# EAGLE board GameBit_Board (EAGLE 9.0.1), part 1 of 2
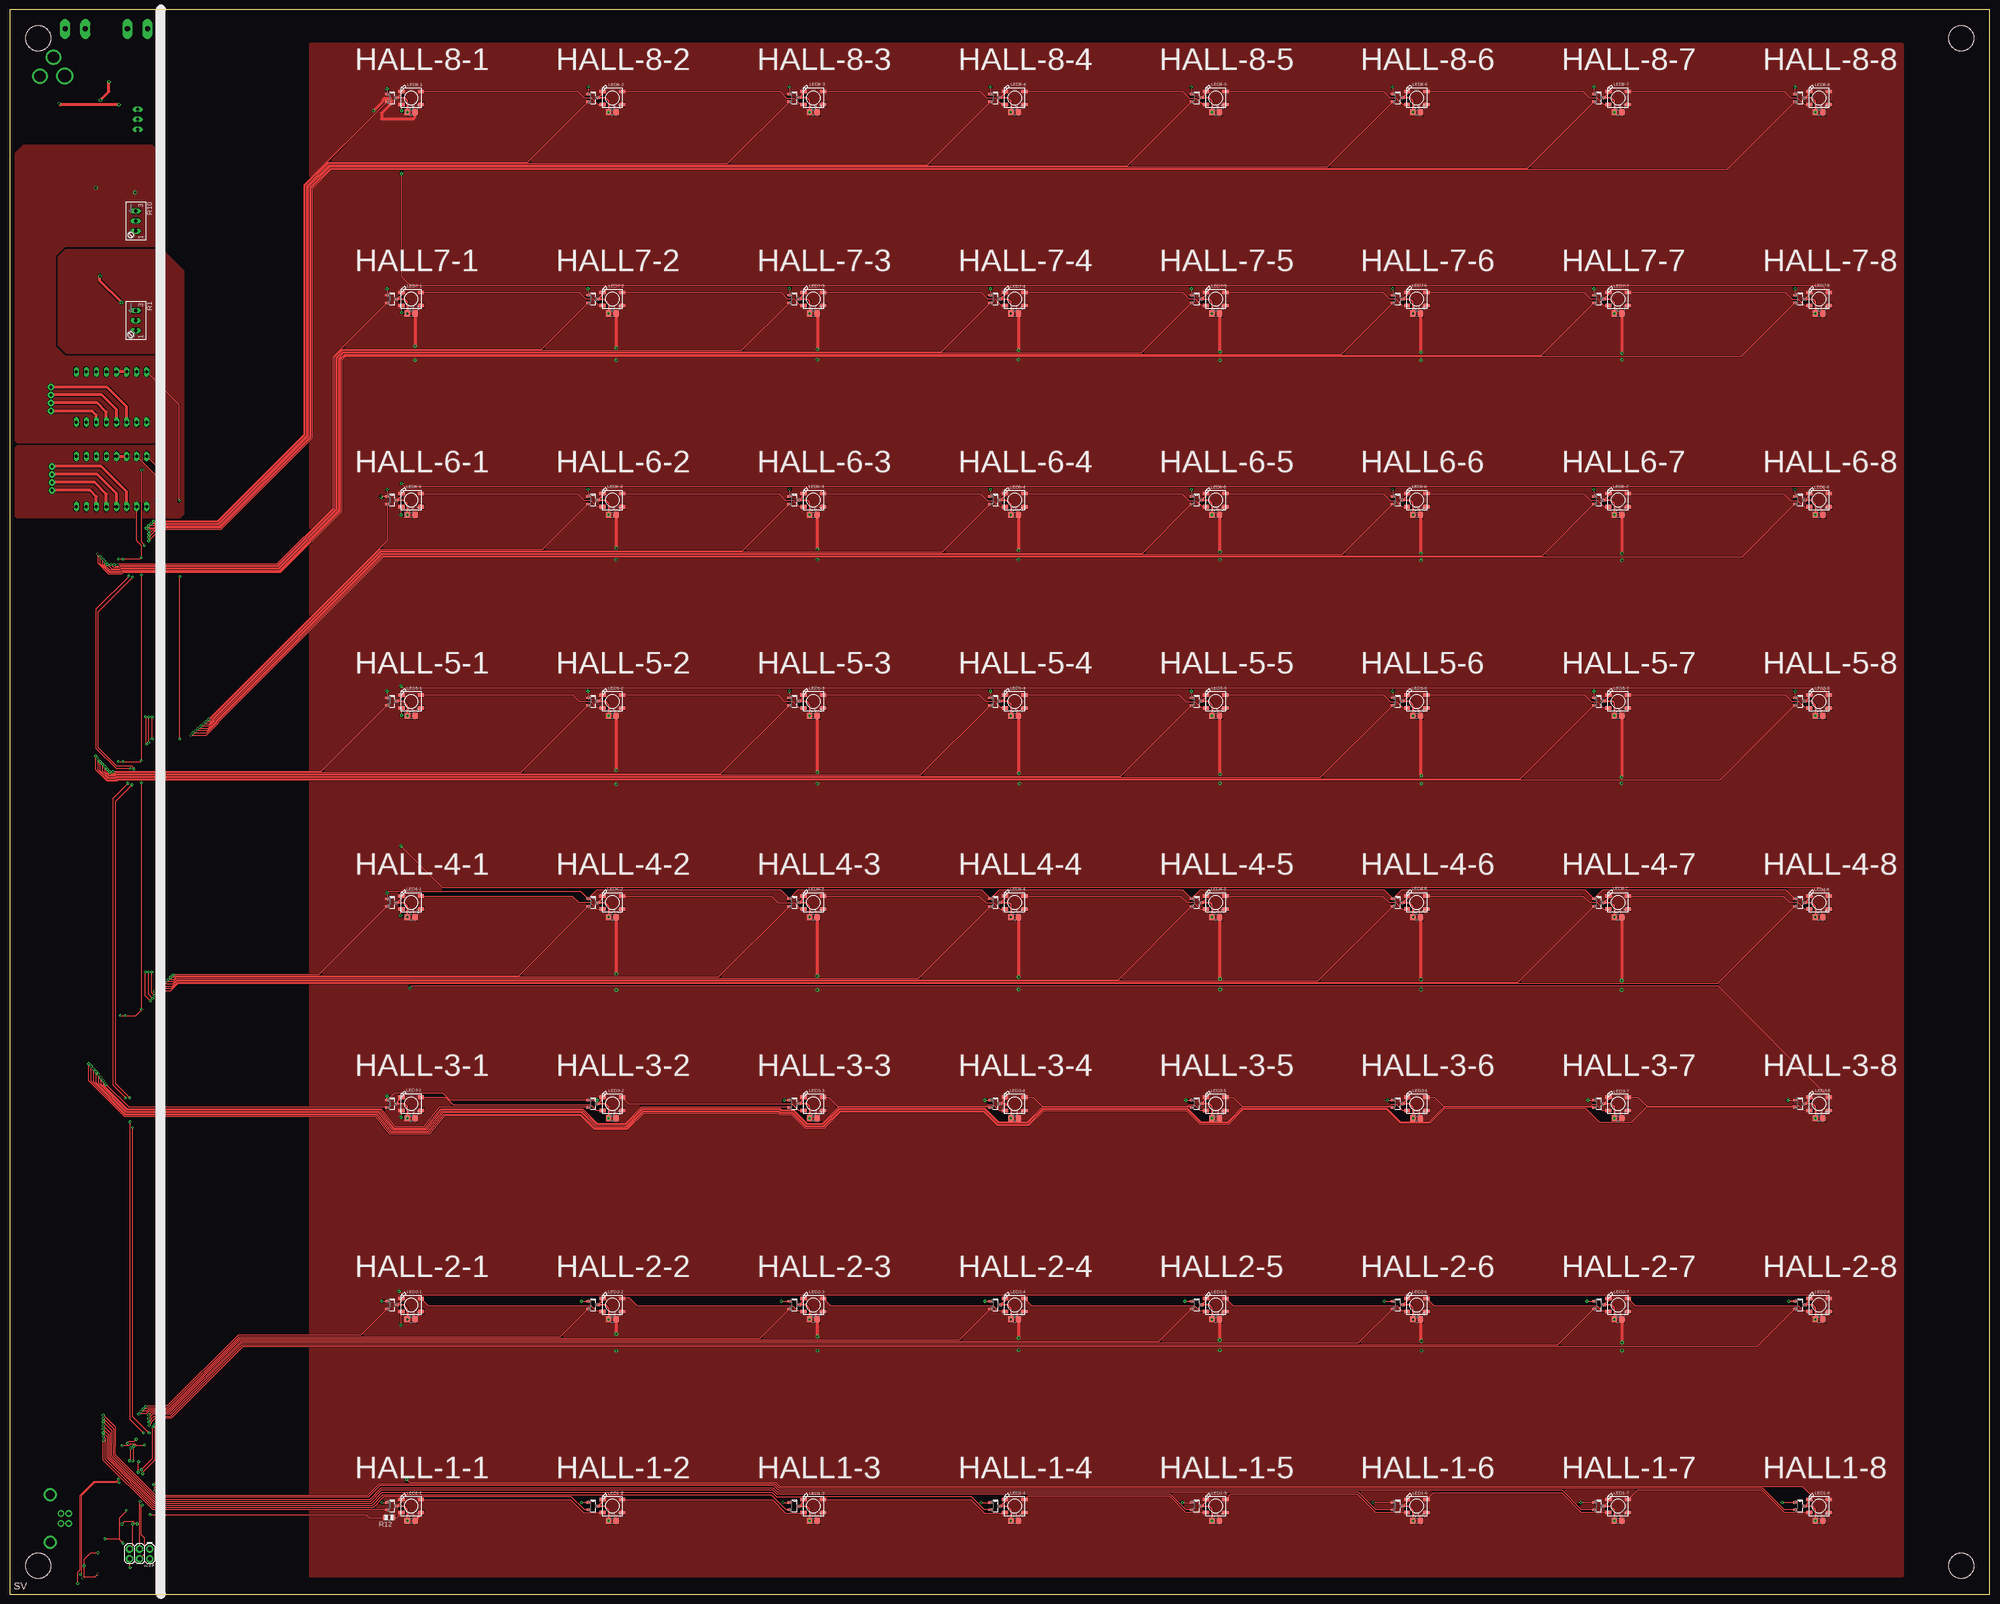
[diagram p3: board, top side]
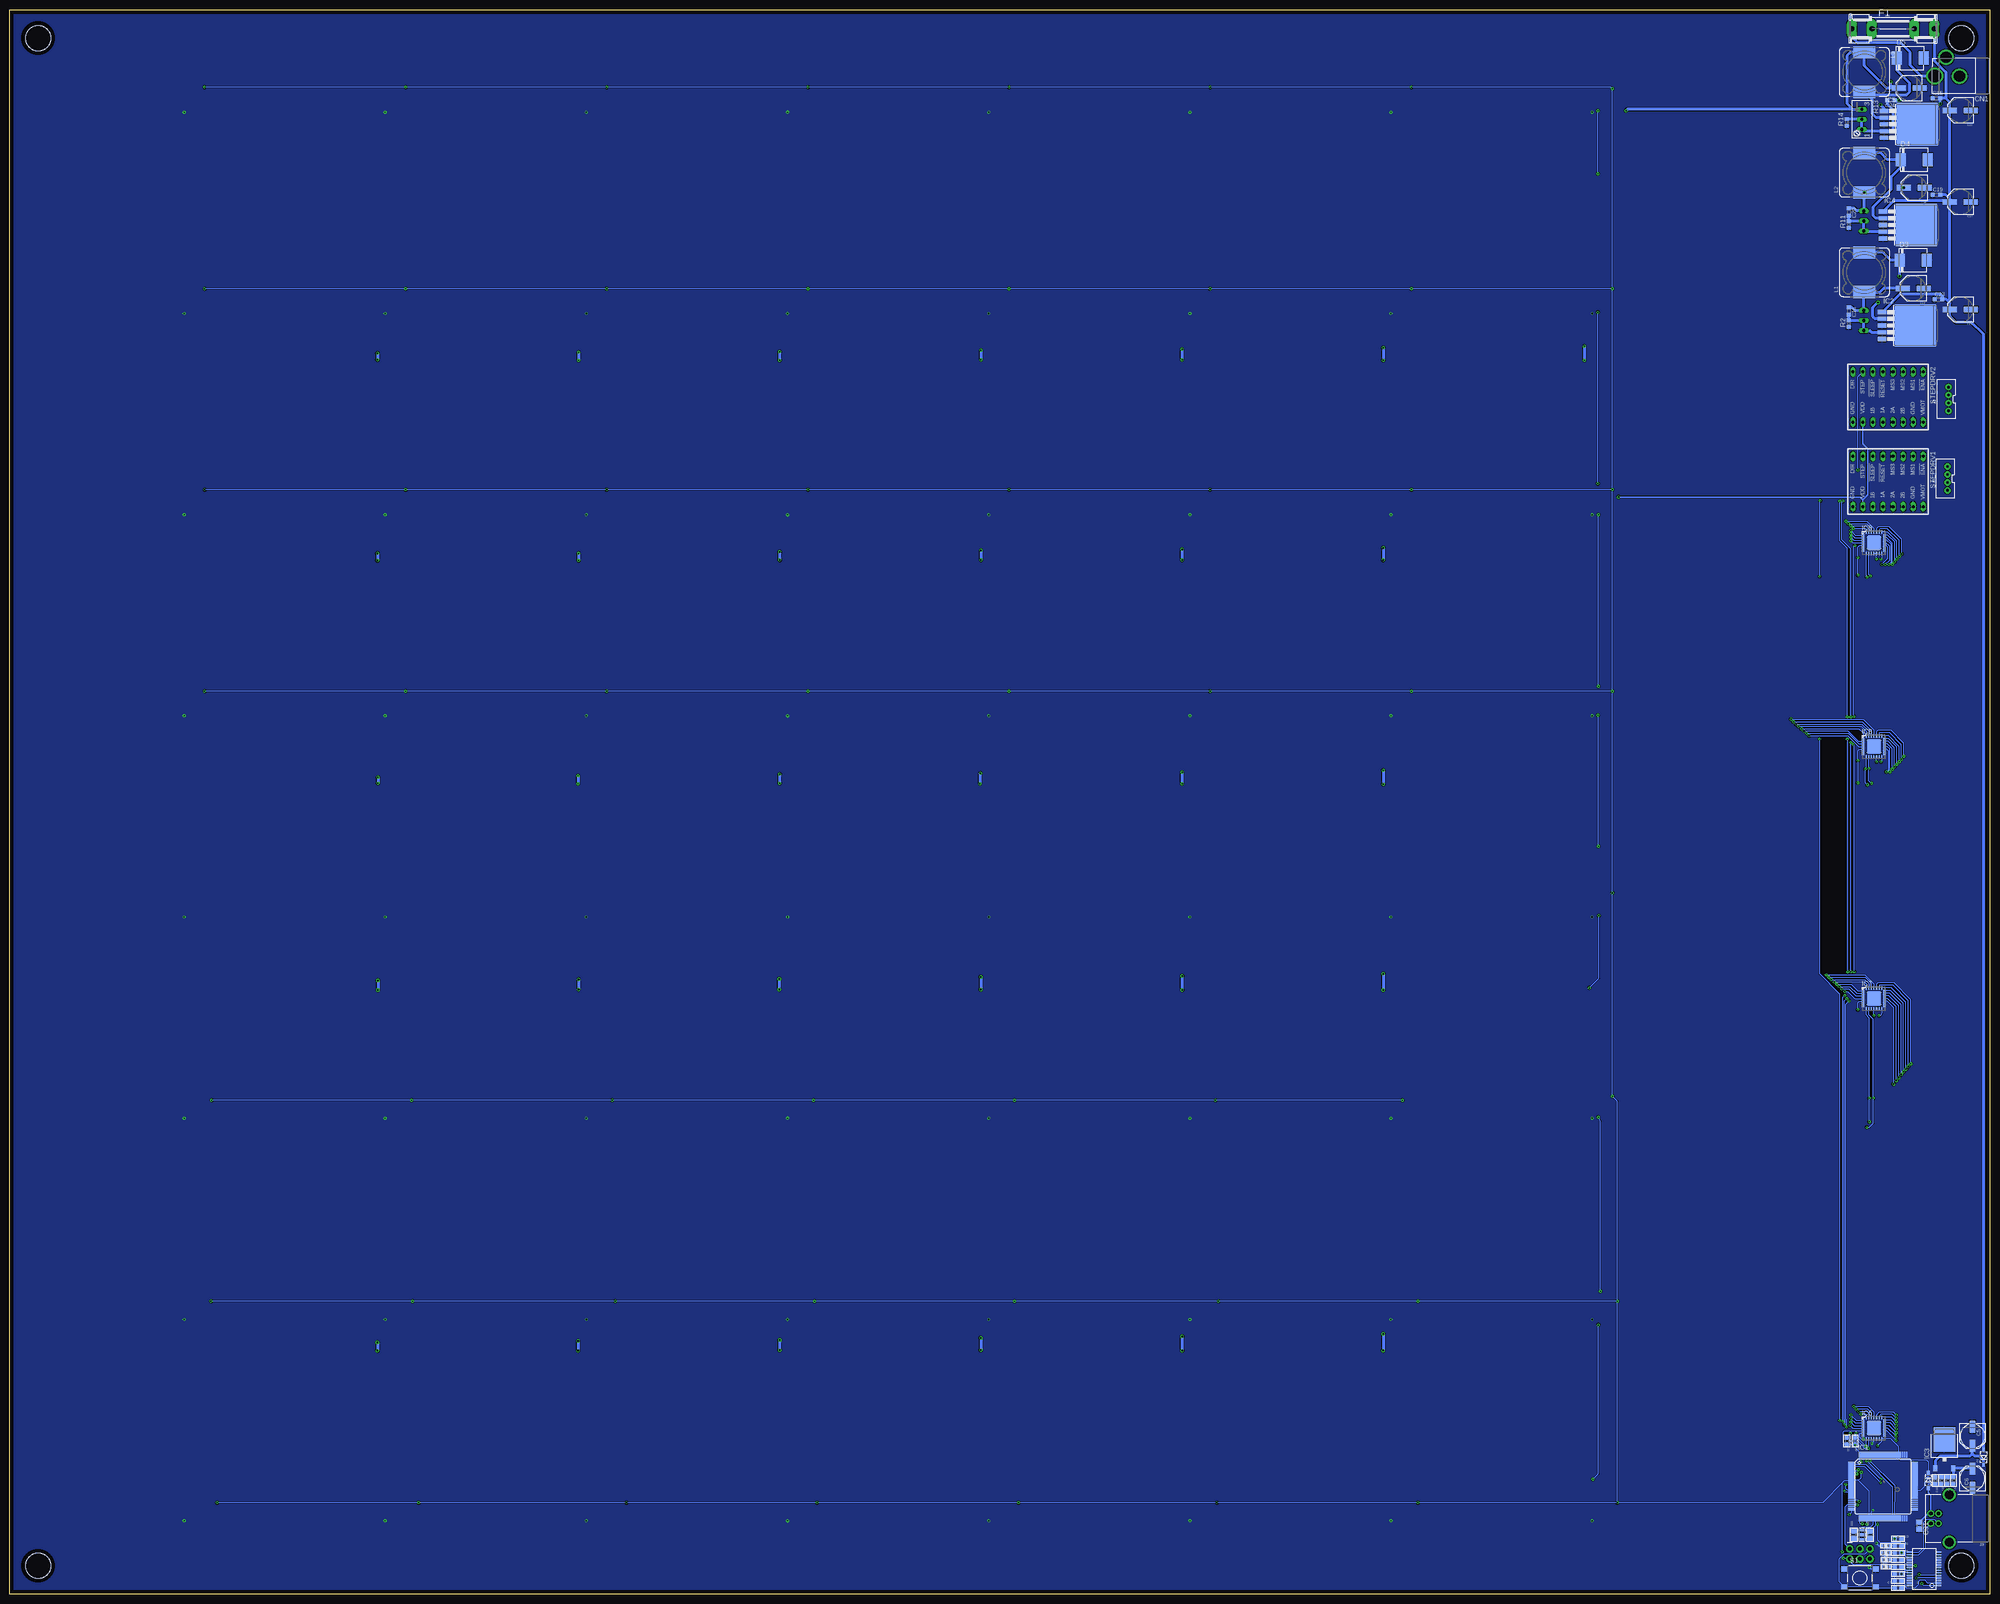
[diagram p4: board, bottom side, seen from below]

Size 500 x 400 mm. Coordinates in mm from the lower left corner, seen from the top.
Outline: 0,0 500,0 500,400 0,400 0,0
Copper layers (1*16): Top 0.035mm / dielectric 1.5mm / Bottom 0.035mm
Design rules "default": minimum track width 6mil, minimum drill 0.35mm, track to track 6mil, track to pad 6mil, pad to pad 6mil, via to via 6mil, smd to smd 6mil, copper to edge 40mil, drill to drill 6mil, minimum pad ring 10mil, minimum via ring 8mil, stop-mask expansion 4mil, vias tented up to drill 0mil, thermal gap 10mil
Holes 6.35 mm at 492.89,7.11 492.89,392.89 7.11,392.89 7.11,7.11

## Footprints (pad centres in the part's own frame; a part is rotated, then mirrored left to right if it is on the bottom)
0603 = smd 1.1 x 1: 1 -0.85,0; 2 0.85,0
0805 = smd 1.27 x 1.524: 1 -0.953,0; 2 0.953,0
PANASONIC_D = smd 3 x 1.4: + 2.4,0; - -2.4,0
PANASONIC_D' = smd 3.556 x 1.4: + 2.654,0; - -2.654,0
0603' = smd 1.016 x 1.016: 1 -0.953,0; 2 0.953,0
C0805 = smd 1.3 x 1.5: 1 -0.85,0; 2 0.85,0
DCJACK_2MM_PTH = drill 2.8: GND 0,7.35; GNDBREAK 4.8,10.75 | drill 3.2: PWR 0,13.6
SOD-123 = smd 1.2 x 0.7: A 1.85,0; C -1.85,0
DO214AB = smd 2.5 x 3.3: A 3.4,0; C -3.4,0
SHK20L = drill 1.321 pad 2.54 long: 1A -10.414,0; 1B -5.334,0; 2A 10.414,0; 2B 5.334,0
SOT95P290X110-3N = smd 0.864 x 0.559: 1 -1.27,0.94; 2 -1.27,-0.94; 3 1.27,0
TQFP100 = smd 1.5 x 0.35: 1 -8,6; 2 -8,5.5; 3 -8,5; 4 -8,4.5; 5 -8,4; 6 -8,3.5; 7 -8,3; 8 -8,2.5; 9 -8,2; 10 -8,1.5; 11 -8,1; 12 -8,0.5; 13 -8,0; 14 -8,-0.5; 15 -8,-1; 16 -8,-1.5; 17 -8,-2; 18 -8,-2.5; 19 -8,-3; 20 -8,-3.5; 21 -8,-4; 22 -8,-4.5; 23 -8,-5; 24 -8,-5.5; 25 -8,-6; 51 8,-6; 52 8,-5.5; 53 8,-5; 54 8,-4.5; 55 8,-4; 56 8,-3.5; 57 8,-3; 58 8,-2.5; 59 8,-2; 60 8,-1.5; 61 8,-1; 62 8,-0.5; 63 8,0; 64 8,0.5; 65 8,1; 66 8,1.5; 67 8,2; 68 8,2.5; 69 8,3; 70 8,3.5; 71 8,4; 72 8,4.5; 73 8,5; 74 8,5.5; 75 8,6 | smd 0.35 x 1.5: 26 -6,-8; 27 -5.5,-8; 28 -5,-8; 29 -4.5,-8; 30 -4,-8; 31 -3.5,-8; 32 -3,-8; 33 -2.5,-8; 34 -2,-8; 35 -1.5,-8; 36 -1,-8; 37 -0.5,-8; 38 0,-8; 39 0.5,-8; 40 1,-8; 41 1.5,-8; 42 2,-8; 43 2.5,-8; 44 3,-8; 45 3.5,-8; 46 4,-8; 47 4.5,-8; 48 5,-8; 49 5.5,-8; 50 6,-8; 76 6,8; 77 5.5,8; 78 5,8; 79 4.5,8; 80 4,8; 81 3.5,8; 82 3,8; 83 2.5,8; 84 2,8; 85 1.5,8; 86 1,8; 87 0.5,8; 88 0,8; 89 -0.5,8; 90 -1,8; 91 -1.5,8; 92 -2,8; 93 -2.5,8; 94 -3,8; 95 -3.5,8; 96 -4,8; 97 -4.5,8; 98 -5,8; 99 -5.5,8; 100 -6,8
TO263-5 = smd 1.067 x 2.159: 1 -3.404,-5.791; 2 -1.702,-5.791; 3 0,-5.791; 4 1.702,-5.791; 5 3.404,-5.791 | smd 10.8 x 10.41: 6 0,2.54
TO252 = smd 1 x 1.6: 1 -2.28,-4.8; 2 2.28,-4.8 | smd 5.4 x 6.2: 3 0,2.5
QFN28-ML_6X6MM = smd 0.7 x 0.35: 1 -2.7,1.95; 2 -2.7,1.3; 3 -2.7,0.65; 4 -2.7,0; 5 -2.7,-0.65; 6 -2.7,-1.3; 7 -2.7,-1.95; 15 2.7,-1.95; 16 2.7,-1.3; 17 2.7,-0.65; 18 2.7,0; 19 2.7,0.65; 20 2.7,1.3; 21 2.7,1.95 | smd 0.35 x 0.7: 8 -1.95,-2.7; 9 -1.3,-2.7; 10 -0.65,-2.7; 11 0,-2.7; 12 0.65,-2.7; 13 1.3,-2.7; 14 1.95,-2.7; 22 1.95,2.7; 23 1.3,2.7; 24 0.65,2.7; 25 0,2.7; 26 -0.65,2.7; 27 -1.3,2.7; 28 -1.95,2.7 | smd 3.7 x 3.7: EXP 0,0
2X3 = drill 1.016 pad 1.88: 1 0,0; 2 0,2.54; 3 2.54,0; 4 2.54,2.54; 5 5.08,0; 6 5.08,2.54
JST-4-PTH-VERT = drill 0.7 pad 1.6: 1 -3,-0.55; 2 -1,-0.55; 3 1,-0.55; 4 3,-0.55
USB-B-PTH = drill 0.914 pad 1.676: D+ 4,1.25; D- 5.981,1.25; GND 4,-1.25; VBUS 5.981,-1.25 | drill 2.286: SHLD1 1.282,-6.02; SHLD2 1.282,6.02
SRR1280 = smd 5.6 x 3.1: 1 0.635,5; 2 0.635,-5
CHIPLED_0603 = smd 0.8 x 0.8: A 0,-0.75; C 0,0.75
WS2812B = smd 1.5 x 0.9: 1-VDD 2.45,-1.65; 2-DOUT 2.45,1.65; 3-GND -2.45,1.65; 4-DIN -2.45,-1.65
S64W = drill 0.813 long: A 2.54,1.27; E -2.54,1.27; S 0,1.27
R0603 = smd 1 x 1.1: 1 -0.85,0; 2 0.85,0
R0805 = smd 1.1 x 1.4: 1 -1,0; 2 1,0
0805' = smd 1.3 x 1.5: 1 -0.95,0; 2 0.95,0
DTSM-6 = smd 1.55 x 1.3: 1 -3.975,2.25; 2 3.975,2.25; 3 -3.975,-2.25; 4 3.975,-2.25
POLOLULU2128 = drill 0.8 long: 1 -7.62,7.62; 2 -7.62,5.08; 3 -7.62,2.54; 4 -7.62,0; 5 -7.62,-2.54; 6 -7.62,-5.08; 7 -7.62,-7.62; 8 -7.62,-10.16; 9 5.08,-10.16; 10 5.08,-7.62; 11 5.08,-5.08; 12 5.08,-2.54; 13 5.08,0; 14 5.08,2.54; 15 5.08,5.08; 16 5.08,7.62
SSOP28DB = smd 0.348 x 1.397: 1 -4.225,-3.656; 2 -3.575,-3.656; 3 -2.925,-3.656; 4 -2.275,-3.656; 5 -1.625,-3.656; 6 -0.975,-3.656; 7 -0.325,-3.656; 8 0.325,-3.656; 9 0.975,-3.656; 10 1.625,-3.656; 11 2.275,-3.656; 12 2.925,-3.656; 13 3.575,-3.656; 14 4.225,-3.656; 15 4.225,3.656; 16 3.575,3.656; 17 2.925,3.656; 18 2.275,3.656; 19 1.625,3.656; 20 0.975,3.656; 21 0.325,3.656; 22 -0.325,3.656; 23 -0.975,3.656; 24 -1.625,3.656; 25 -2.275,3.656; 26 -2.925,3.656; 27 -3.575,3.656; 28 -4.225,3.656
RESONATOR-SMD = smd 0.7 x 1.7: 1 -1.2,0; 2 0,0; 3 1.2,0

## Placement (x,y rotation side)
C1  0.1uF  [0603]  9.14,28.7 270 bottom
C1-1  0.1uF  [0805]  101.35,18.54 0 top
C1-2  0.1uF  [0805]  152.15,18.54 0 top
C1-3  0.1uF  [0805]  202.95,18.54 0 top
C1-4  0.1uF  [0805]  253.75,18.54 0 top
C1-5  0.1uF  [0805]  304.55,18.54 0 top
C1-6  0.1uF  [0805]  355.35,18.54 0 top
C1-7  0.1uF  [0805]  406.15,18.54 0 top
C1-8  0.1uF  [0805]  456.95,18.54 0 top
C2  0.1uF  [0603]  10.67,28.7 270 bottom
C2-1  0.1uF  [0805]  101.35,69.34 0 top
C2-2  0.1uF  [0805]  152.15,69.34 0 top
C2-3  0.1uF  [0805]  202.95,69.34 0 top
C2-4  0.1uF  [0805]  253.75,69.34 0 top
C2-5  0.1uF  [0805]  304.55,69.34 0 top
C2-6  0.1uF  [0805]  355.35,69.34 0 top
C2-7  0.1uF  [0805]  406.15,69.34 0 top
C2-8  0.1uF  [0805]  456.95,69.34 0 top
C3  0.1uF  [0603]  12.19,28.7 270 bottom
C3-1  0.1uF  [0805]  101.35,120.14 0 top
C3-2  0.1uF  [0805]  152.15,120.14 0 top
C3-3  0.1uF  [0805]  202.95,120.14 0 top
C3-4  0.1uF  [0805]  253.75,120.14 0 top
C3-5  0.1uF  [0805]  304.55,120.14 0 top
C3-6  0.1uF  [0805]  355.35,120.14 0 top
C3-7  0.1uF  [0805]  406.15,120.14 0 top
C3-8  0.1uF  [0805]  456.95,120.14 0 top
C4  22pF  [0603]  23.11,1.52 0 bottom
C4-1  0.1uF  [0805]  101.35,170.94 0 top
C4-2  0.1uF  [0805]  152.15,170.94 0 top
C4-3  0.1uF  [0805]  202.95,170.94 0 top
C4-4  0.1uF  [0805]  253.75,170.94 0 top
C4-5  0.1uF  [0805]  304.55,170.94 0 top
C4-6  0.1uF  [0805]  355.35,170.94 0 top
C4-7  0.1uF  [0805]  406.15,170.94 0 top
C4-8  0.1uF  [0805]  456.95,170.94 0 top
C5  47uF  [PANASONIC_D]  4.32,39.88 270 bottom
C5-1  0.1uF  [0805]  101.35,221.74 0 top
C5-2  0.1uF  [0805]  152.15,221.74 0 top
C5-3  0.1uF  [0805]  202.95,221.74 0 top
C5-4  0.1uF  [0805]  253.75,221.74 0 top
C5-5  0.1uF  [0805]  304.55,221.74 0 top
C5-6  0.1uF  [0805]  355.35,221.74 0 top
C5-7  0.1uF  [0805]  406.15,221.74 0 top
C5-8  0.1uF  [0805]  456.95,221.74 0 top
C6  47uF  [PANASONIC_D]  4.32,29.21 90 bottom
C6-1  0.1uF  [0805]  101.35,272.54 0 top
C6-2  0.1uF  [0805]  152.15,272.54 0 top
C6-3  0.1uF  [0805]  202.95,272.54 0 top
C6-4  0.1uF  [0805]  253.75,272.54 0 top
C6-5  0.1uF  [0805]  304.55,272.54 0 top
C6-6  0.1uF  [0805]  355.35,272.54 0 top
C6-7  0.1uF  [0805]  406.15,272.54 0 top
C6-8  0.1uF  [0805]  456.95,272.54 0 top
C7  22pF  [0603]  23.11,3.3 180 bottom
C7-1  0.1uF  [0805]  101.35,323.34 0 top
C7-2  0.1uF  [0805]  152.15,323.34 0 top
C7-3  0.1uF  [0805]  202.95,323.34 0 top
C7-4  0.1uF  [0805]  253.75,323.34 0 top
C7-5  0.1uF  [0805]  304.55,323.34 0 top
C7-6  0.1uF  [0805]  355.35,323.34 0 top
C7-7  0.1uF  [0805]  406.15,323.34 0 top
C7-8  0.1uF  [0805]  456.95,323.34 0 top
C8  0.1uF  [0603]  23.11,13.97 0 bottom
C8-1  0.1uF  [0805]  101.35,374.14 0 top
C8-2  0.1uF  [0805]  152.15,374.14 0 top
C8-3  0.1uF  [0805]  202.95,374.14 0 top
C8-4\  0.1uF  [0805]  253.75,374.14 0 top
C8-5  0.1uF  [0805]  304.55,374.14 0 top
C8-6  0.1uF  [0805]  355.35,374.14 0 top
C8-7  0.1uF  [0805]  406.15,374.14 0 top
C8-8  0.1uF  [0805]  456.95,374.14 0 top
C10  0.1uF  [0603]  13.72,28.7 270 bottom
C13  220uF@35V  [PANASONIC_D']  7.37,374.65 180 bottom
C14  220uF@35V  [PANASONIC_D']  19.3,329.69 180 bottom
C15  100nF  [0603']  13.46,377.7 0 bottom
C16  [0603']  35.56,323.98 270 bottom
C17  220uF@35V  [PANASONIC_D']  7.37,351.54 180 bottom
C18  220uF@35V  [PANASONIC_D']  19.05,355.09 180 bottom
C19  100nF  [0603']  13.46,353.31 0 bottom
C20  [0603']  35.56,349 270 bottom
C21  220uF@35V  [PANASONIC_D']  7.37,324.36 180 bottom
C22  220uF@35V  [PANASONIC_D']  20.32,380.24 180 bottom
C23  100nF  [0603']  12.95,326.9 0 bottom
C24  [0603']  24.89,377.19 180 bottom
C31  4.7uF  [C0805]  17.78,17.27 270 bottom
CN1  [DCJACK_2MM_PTH]  0.25,383.29 90 bottom
D1  [SOD-123]  1.52,34.54 90 bottom
D2  [SOD-123]  15.49,28.7 270 bottom
D3  SS54  [DO214AB]  19.3,336.8 0 bottom
D4  SS54  [DO214AB]  19.05,362.2 0 bottom
D5  SS54  [DO214AB]  20.07,387.86 0 bottom
F1  [SHK20L]  24.38,395.22 0 bottom
HALL1-3  A1120ELHLT-T  [SOT95P290X110-3N]  198.12,22.2 0 top
HALL1-8  A1120ELHLT-T  [SOT95P290X110-3N]  452.12,22.2 0 top
HALL2-5  A1120ELHLT-T  [SOT95P290X110-3N]  299.72,73 0 top
HALL4-3  A1120ELHLT-T  [SOT95P290X110-3N]  198.12,174.6 0 top
HALL4-4  A1120ELHLT-T  [SOT95P290X110-3N]  248.92,174.6 0 top
HALL5-6  A1120ELHLT-T  [SOT95P290X110-3N]  350.52,225.4 0 top
HALL6-6  A1120ELHLT-T  [SOT95P290X110-3N]  350.52,276.2 0 top
HALL6-7  A1120ELHLT-T  [SOT95P290X110-3N]  401.32,276.2 0 top
HALL7-1  A1120ELHLT-T  [SOT95P290X110-3N]  96.52,327 0 top
HALL7-2  A1120ELHLT-T  [SOT95P290X110-3N]  147.32,327 0 top
HALL7-7  A1120ELHLT-T  [SOT95P290X110-3N]  401.32,327 0 top
HALL-1-1  A1120ELHLT-T  [SOT95P290X110-3N]  96.52,22.2 0 top
HALL-1-2  A1120ELHLT-T  [SOT95P290X110-3N]  147.32,22.2 0 top
HALL-1-4  A1120ELHLT-T  [SOT95P290X110-3N]  248.92,22.2 0 top
HALL-1-5  A1120ELHLT-T  [SOT95P290X110-3N]  299.72,22.2 0 top
HALL-1-6  A1120ELHLT-T  [SOT95P290X110-3N]  350.52,22.2 0 top
HALL-1-7  A1120ELHLT-T  [SOT95P290X110-3N]  401.32,22.2 0 top
HALL-2-1  A1120ELHLT-T  [SOT95P290X110-3N]  96.52,73 0 top
HALL-2-2  A1120ELHLT-T  [SOT95P290X110-3N]  147.32,73 0 top
HALL-2-3  A1120ELHLT-T  [SOT95P290X110-3N]  198.12,73 0 top
HALL-2-4  A1120ELHLT-T  [SOT95P290X110-3N]  248.92,73 0 top
HALL-2-6  A1120ELHLT-T  [SOT95P290X110-3N]  350.52,73 0 top
HALL-2-7  A1120ELHLT-T  [SOT95P290X110-3N]  401.32,73 0 top
HALL-2-8  A1120ELHLT-T  [SOT95P290X110-3N]  452.12,73 0 top
HALL-3-1  A1120ELHLT-T  [SOT95P290X110-3N]  96.52,123.8 0 top
HALL-3-2  A1120ELHLT-T  [SOT95P290X110-3N]  147.32,123.8 0 top
HALL-3-3  A1120ELHLT-T  [SOT95P290X110-3N]  198.12,123.8 0 top
HALL-3-4  A1120ELHLT-T  [SOT95P290X110-3N]  248.92,123.8 0 top
HALL-3-5  A1120ELHLT-T  [SOT95P290X110-3N]  299.72,123.8 0 top
HALL-3-6  A1120ELHLT-T  [SOT95P290X110-3N]  350.52,123.8 0 top
HALL-3-7  A1120ELHLT-T  [SOT95P290X110-3N]  401.32,123.8 0 top
HALL-3-8  A1120ELHLT-T  [SOT95P290X110-3N]  452.12,123.8 0 top
HALL-4-1  A1120ELHLT-T  [SOT95P290X110-3N]  96.52,174.6 0 top
HALL-4-2  A1120ELHLT-T  [SOT95P290X110-3N]  147.32,174.6 0 top
HALL-4-5  A1120ELHLT-T  [SOT95P290X110-3N]  299.72,174.6 0 top
HALL-4-6  A1120ELHLT-T  [SOT95P290X110-3N]  350.52,174.6 0 top
HALL-4-7  A1120ELHLT-T  [SOT95P290X110-3N]  401.32,174.6 0 top
HALL-4-8  A1120ELHLT-T  [SOT95P290X110-3N]  452.12,174.6 0 top
HALL-5-1  A1120ELHLT-T  [SOT95P290X110-3N]  96.52,225.4 0 top
HALL-5-2  A1120ELHLT-T  [SOT95P290X110-3N]  147.32,225.4 0 top
HALL-5-3  A1120ELHLT-T  [SOT95P290X110-3N]  198.12,225.4 0 top
HALL-5-4  A1120ELHLT-T  [SOT95P290X110-3N]  248.92,225.4 0 top
HALL-5-5  A1120ELHLT-T  [SOT95P290X110-3N]  299.72,225.4 0 top
HALL-5-7  A1120ELHLT-T  [SOT95P290X110-3N]  401.32,225.4 0 top
HALL-5-8  A1120ELHLT-T  [SOT95P290X110-3N]  452.12,225.4 0 top
HALL-6-1  A1120ELHLT-T  [SOT95P290X110-3N]  96.52,276.2 0 top
HALL-6-2  A1120ELHLT-T  [SOT95P290X110-3N]  147.32,276.2 0 top
HALL-6-3  A1120ELHLT-T  [SOT95P290X110-3N]  198.12,276.2 0 top
HALL-6-4  A1120ELHLT-T  [SOT95P290X110-3N]  248.92,276.2 0 top
HALL-6-5  A1120ELHLT-T  [SOT95P290X110-3N]  299.72,276.2 0 top
HALL-6-8  A1120ELHLT-T  [SOT95P290X110-3N]  452.12,276.2 0 top
HALL-7-3  A1120ELHLT-T  [SOT95P290X110-3N]  198.12,327 0 top
HALL-7-4  A1120ELHLT-T  [SOT95P290X110-3N]  248.92,327 0 top
HALL-7-5  A1120ELHLT-T  [SOT95P290X110-3N]  299.72,327 0 top
HALL-7-6  A1120ELHLT-T  [SOT95P290X110-3N]  350.52,327 0 top
HALL-7-8  A1120ELHLT-T  [SOT95P290X110-3N]  452.12,327 0 top
HALL-8-1  A1120ELHLT-T  [SOT95P290X110-3N]  96.52,377.8 0 top
HALL-8-2  A1120ELHLT-T  [SOT95P290X110-3N]  147.32,377.8 0 top
HALL-8-3  A1120ELHLT-T  [SOT95P290X110-3N]  198.12,377.8 0 top
HALL-8-4  A1120ELHLT-T  [SOT95P290X110-3N]  248.92,377.8 0 top
HALL-8-5  A1120ELHLT-T  [SOT95P290X110-3N]  299.72,377.8 0 top
HALL-8-6  A1120ELHLT-T  [SOT95P290X110-3N]  350.52,377.8 0 top
HALL-8-7  A1120ELHLT-T  [SOT95P290X110-3N]  401.32,377.8 0 top
HALL-8-8  A1120ELHLT-T  [SOT95P290X110-3N]  452.12,377.8 0 top
IC1  ATMEGA640-16AI  [TQFP100]  26.92,27.18 0 bottom
IC2  LM2596S  [TO263-5]  21.34,320.29 270 bottom
IC3  7812DT  [TO252]  11.43,36.58 0 bottom
IC4  LM2596S  [TO263-5]  21.08,345.69 270 bottom
IC5  LM2596S  [TO263-5]  20.83,371.09 270 bottom
IC6  MCP23017ML  [QFN28-ML_6X6MM]  29.21,41.91 0 bottom
IC7  MCP23017ML  [QFN28-ML_6X6MM]  29.21,150.37 0 bottom
IC8  MCP23017ML  [QFN28-ML_6X6MM]  29.21,214 0 bottom
IC9  MCP23017ML  [QFN28-ML_6X6MM]  29.21,265.43 0 bottom
ICSP  FEMALE 2x3  [2X3]  35.31,11.43 180 top
J1  [JST-4-PTH-VERT]  11.18,281.69 90 bottom
J2  [JST-4-PTH-VERT]  10.92,301.75 90 bottom
J3  USB_B_PTH  [USB-B-PTH]  8.89,19.05 180 bottom
L1  SRR1280-330mH  [SRR1280]  32.26,333.76 0 bottom
L2  SRR1280-330mH  [SRR1280]  32.26,358.9 0 bottom
L3  SRR1280-330mH  [SRR1280]  30.99,384.3 180 bottom
LED1  GREEN  [CHIPLED_0603]  26.16,10.41 90 bottom
LED1-1  WS2812B5050  [WS2812B]  101.35,22.2 0 top
LED1-2  WS2812B5050  [WS2812B]  152.15,22.2 0 top
LED1-3  WS2812B5050  [WS2812B]  202.95,22.2 0 top
LED1-4  WS2812B5050  [WS2812B]  253.75,22.2 0 top
LED1-5  WS2812B5050  [WS2812B]  304.55,22.2 0 top
LED1-6  WS2812B5050  [WS2812B]  355.35,22.2 0 top
LED1-7  WS2812B5050  [WS2812B]  406.15,22.2 0 top
LED1-8  WS2812B5050  [WS2812B]  456.95,22.2 0 top
LED2  YELLOW  [CHIPLED_0603]  26.16,12.19 90 bottom
LED2-1  WS2812B5050  [WS2812B]  101.35,73 0 top
LED2-2  WS2812B5050  [WS2812B]  152.15,73 0 top
LED2-3  WS2812B5050  [WS2812B]  202.95,73 0 top
LED2-4  WS2812B5050  [WS2812B]  253.75,73 0 top
LED2-5  WS2812B5050  [WS2812B]  304.55,73 0 top
LED2-6  WS2812B5050  [WS2812B]  355.35,73 0 top
LED2-7  WS2812B5050  [WS2812B]  406.15,73 0 top
LED2-8  WS2812B5050  [WS2812B]  456.95,73 0 top
LED3  BLUE  [CHIPLED_0603]  26.16,6.86 270 bottom
LED3-1  WS2812B5050  [WS2812B]  101.35,123.8 0 top
LED3-2  WS2812B5050  [WS2812B]  152.15,123.8 0 top
LED3-3  WS2812B5050  [WS2812B]  202.95,123.8 0 top
LED3-4  WS2812B5050  [WS2812B]  253.75,123.8 0 top
LED3-5  WS2812B5050  [WS2812B]  304.55,123.8 0 top
LED3-6  WS2812B5050  [WS2812B]  355.35,123.8 0 top
LED3-7  WS2812B5050  [WS2812B]  406.15,123.8 0 top
LED3-8  WS2812B5050  [WS2812B]  456.95,123.8 0 top
LED4  RED  [CHIPLED_0603]  26.16,8.64 270 bottom
LED4-1  WS2812B5050  [WS2812B]  101.35,174.6 0 top
LED4-2  WS2812B5050  [WS2812B]  152.15,174.6 0 top
LED4-3  WS2812B5050  [WS2812B]  202.95,174.6 0 top
LED4-4  WS2812B5050  [WS2812B]  253.75,174.6 0 top
LED4-5  WS2812B5050  [WS2812B]  304.55,174.6 0 top
LED4-6  WS2812B5050  [WS2812B]  355.35,174.6 0 top
LED4-7  WS2812B5050  [WS2812B]  406.15,174.6 0 top
LED4-8  WS2812B5050  [WS2812B]  456.95,174.6 0 top
LED5-1  WS2812B5050  [WS2812B]  101.35,225.4 0 top
LED5-2  WS2812B5050  [WS2812B]  152.15,225.4 0 top
LED5-3  WS2812B5050  [WS2812B]  202.95,225.4 0 top
LED5-4  WS2812B5050  [WS2812B]  253.75,225.4 0 top
LED5-5  WS2812B5050  [WS2812B]  304.55,225.4 0 top
LED5-6  WS2812B5050  [WS2812B]  355.35,225.4 0 top
LED5-7  WS2812B5050  [WS2812B]  406.15,225.4 0 top
LED5-8  WS2812B5050  [WS2812B]  456.95,225.4 0 top
LED6-1  WS2812B5050  [WS2812B]  101.35,276.2 0 top
LED6-2  WS2812B5050  [WS2812B]  152.15,276.2 0 top
LED6-3  WS2812B5050  [WS2812B]  202.95,276.2 0 top
LED6-4  WS2812B5050  [WS2812B]  253.75,276.2 0 top
LED6-5  WS2812B5050  [WS2812B]  304.55,276.2 0 top
LED6-6  WS2812B5050  [WS2812B]  355.35,276.2 0 top
LED6-7  WS2812B5050  [WS2812B]  406.15,276.2 0 top
LED6-8  WS2812B5050  [WS2812B]  456.95,276.2 0 top
LED7-1  WS2812B5050  [WS2812B]  101.35,327 0 top
LED7-2  WS2812B5050  [WS2812B]  152.15,327 0 top
LED7-3  WS2812B5050  [WS2812B]  202.95,327 0 top
LED7-4  WS2812B5050  [WS2812B]  253.75,327 0 top
LED7-5  WS2812B5050  [WS2812B]  304.55,327 0 top
LED7-6  WS2812B5050  [WS2812B]  355.35,327 0 top
LED7-7  WS2812B5050  [WS2812B]  406.15,327 0 top
LED7-8  WS2812B5050  [WS2812B]  456.95,327 0 top
LED8-1  WS2812B5050  [WS2812B]  101.35,377.8 0 top
LED8-2  WS2812B5050  [WS2812B]  152.15,377.8 0 top
LED8-3  WS2812B5050  [WS2812B]  202.95,377.8 0 top
LED8-4  WS2812B5050  [WS2812B]  253.75,377.8 0 top
LED8-5  WS2812B5050  [WS2812B]  304.55,377.8 0 top
LED8-6  WS2812B5050  [WS2812B]  355.35,377.8 0 top
LED8-7  WS2812B5050  [WS2812B]  406.15,377.8 0 top
LED8-8  WS2812B5050  [WS2812B]  456.95,377.8 0 top
R1  10k  [S64W]  30.48,321.56 270 top
R2  330  [R0603]  35.56,320.8 90 bottom
R3  10k  [0603]  23.11,5.08 0 bottom
R4  1k  [0603]  23.11,10.41 0 bottom
R5  1k  [0603]  23.11,12.19 0 bottom
R6  10k  [0603]  34.04,38.61 270 bottom
R7  10k  [0603]  36.07,38.61 270 bottom
R8  680  [0603]  23.11,6.86 0 bottom
R9  680  [0603]  23.11,8.64 0 bottom
R10  10k  [S64W]  30.48,346.71 270 top
R11  330  [R0603]  35.56,345.82 90 bottom
R12  100  [R0805]  95.76,19.3 180 top
R13  10k  [S64W]  33.53,372.36 270 bottom
R14  330  [R0603]  36.07,371.6 90 bottom
R15  1m  [0805']  34.29,14.99 90 bottom
R16  1m  [0805']  30.23,14.99 90 bottom
S1  DTSM-6  [DTSM-6]  32.77,4.06 0 bottom
STEPDRV1  POLOLULU2128  [POLOLULU2128]  24.38,279.65 270 bottom
STEPDRV2  POLOLULU2128  [POLOLULU2128]  24.38,300.99 270 bottom
U1  [SSOP28DB]  16.51,6.35 90 bottom
U$50  RESONATORSMD  [RESONATOR-SMD]  32.26,14.99 270 bottom